# Altium project CANSAT-Measurement-PWR-Charger.PrjPcb
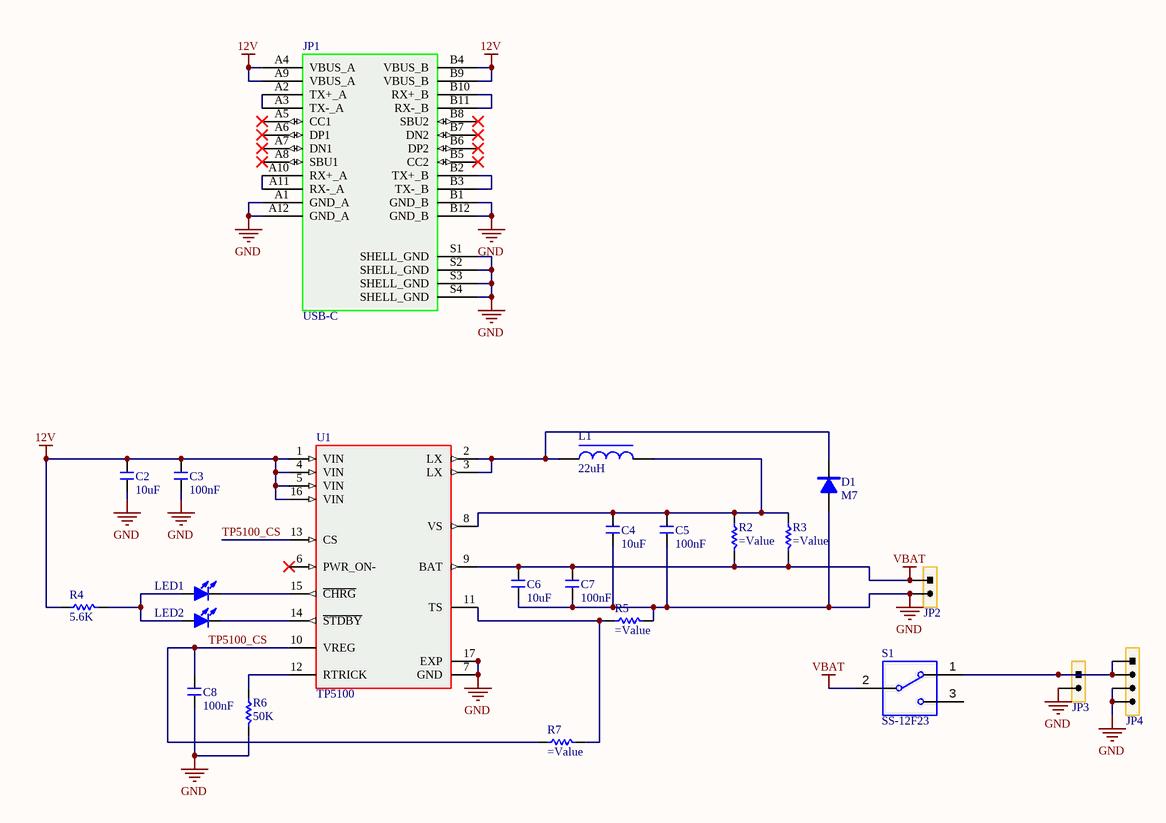
[diagram p0: Main.SchDoc]
1 sheet, 23 parts. Net scope: global (net labels, ports and power ports of the same name join across sheets).
Board file: CANSAT-Measurement-PWR-Charger PCB.PcbDoc

## Sheet Main.SchDoc
size A4; SheetNumber: 1; SheetTotal: 1

### Parts
C2  10uF  [C 0805]
C3  100nF  [C 0805]
C4  10uF  [C 0805]
C5  100nF  [C 0805]
C6  10uF  [C 0805]
C7  100nF  [C 0805]
C8  100nF  [C 0805]
D1  M7  [SMA]
JP1  USB-C  [USB-C-RIGHT]
JP2  HDR-1X2  [XH2.54-2P_H]  (value not drawn)
JP3  HDR-1X2  [XH2.54-2P_H]  (value not drawn)
JP4  HDR-1X4  [HDR-1X4]  (value not drawn)
L1  22uH  [CD54]
LED1  LED-SMD  [LED 0603R]  (value not drawn)
LED2  LED-SMD  [LED 0603B]  (value not drawn)
R2  (no value)  [R 1206]
R3  (no value)  [R 1206]
R4  5.6K  [R 0805]
R5  (no value)  [R 0805]
R6  50K  [R 0805]
R7  (no value)  [R 0805]
S1  SS-12F23  [SS-12F23]
U1  TP5100  [QFN16_4*4]

### Nets
12V: C2.2 C3.2 JP1.A4(VBUS_A) JP1.A9(VBUS_A) JP1.B4(VBUS_B) JP1.B9(VBUS_B) R4.1 U1.1(VIN) U1.4(VIN) U1.5(VIN) U1.16(VIN)
GND: C2.1 C3.1 C4.1 C5.1 C6.1 C7.1 C8.1 D1.1(A) JP1.A1(GND_A) JP1.A12(GND_A) JP1.B1(GND_B) JP1.B12(GND_B) JP1.S1(SHELL_GND) JP1.S2(SHELL_GND) JP1.S3(SHELL_GND) JP1.S4(SHELL_GND) JP2.2 JP3.2 JP4.3 JP4.4 R5.2 R6.2 U1.7(GND) U1.17(EXP)
VBAT: C6.2 C7.2 JP2.1 R2.2 R3.2 S1.2 U1.9(BAT)
TP5100_CS: C8.2 R7.1 U1.10(VREG) U1.13(CS)
NetC4_2: C4.2 C5.2 L1.2 R2.1 R3.1 U1.8(VS)
NetD1_2: D1.2(K) L1.1 U1.2(LX) U1.3(LX)
NetJP1_A2: JP1.A2(TX+_A) JP1.A3(TX-_A)
NetJP1_A10: JP1.A10(RX+_A) JP1.A11(RX-_A)
NetJP1_B2: JP1.B2(TX+_B) JP1.B3(TX-_B)
NetJP1_B10: JP1.B10(RX+_B) JP1.B11(RX-_B)
NetJP3_1: JP3.1 JP4.1 JP4.2 S1.1
NetLED1_1: LED1.1(A) LED2.1(A) R4.2
NetLED1_2: LED1.2(K) U1.15(~{CHRG})
NetLED2_2: LED2.2(K) U1.14(~{STDBY})
NetR5_1: R5.1 R7.2 U1.11(TS)
NetR6_1: R6.1 U1.12(RTRICK)

Not connected (* = marked no-connect by the designer): JP1 A5(CC1)* A6(DP1)* A7(DN1)* A8(SBU1)* B5(CC2)* B6(DP2)* B7(DN2)* B8(SBU2)*; S1 3; U1 6(PWR_ON-)*

### Library data of the parts
C2-C8 = C: Non-polar patch capacitor; BOM名称: 无极性贴片电容; 版权归属: 源创客; 学习资源: www.ooocke.com
D1 = M7: Rectifier diode; BOM名称: 整流二极管; 版权归属: 源创客; 学习资源: www.ooocke.com
JP1 = USB-C-RIGHT
JP2 JP3 = Header 2: 2P Connector; BOM名称: 2P接插件; 版权归属: 源创客; 学习资源: www.ooocke.com
JP4 = Header 4: 4P Connector; BOM名称: 4P接插件; 版权归属: 源创客; 学习资源: www.ooocke.com
L1 = L-CD: Chip power inductor; BOM名称: 功率电感; 版权归属: 源创客; 学习资源: www.ooocke.com
LED1 LED2 = LED-SMD: Patch LED; BOM名称: 贴片LED; 版权归属: 源创客; 学习资源: www.ooocke.com
R2-R7 = R: Chip resistor; 版权归属: 源创客; BOM名称: Chip resistor; 学习资源: www.ooocke.com
S1 = SSW-1P: 1-Way Sliding Switch; BOM名称: 波动开关; 版权归属: 源创客; 学习资源: www.ooocke.com
U1 = TP5100: Battery Charger